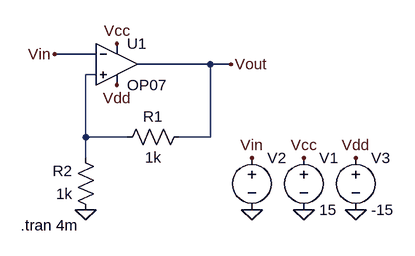
[diagram p0: schematic Trigger_2.asc]
Trigger_2.asc, the LTspice schematic file:
Version 4
SHEET 1 880 680
WIRE 80 64 16 64
WIRE 256 80 144 80
WIRE 288 80 256 80
WIRE 80 96 64 96
WIRE 64 192 64 96
WIRE 128 192 64 192
WIRE 256 192 256 80
WIRE 256 192 208 192
WIRE 64 224 64 192
FLAG 16 64 Vin
FLAG 320 224 Vin
FLAG 400 224 Vcc
FLAG 112 48 Vcc
FLAG 480 224 Vdd
FLAG 112 112 Vdd
FLAG 288 80 Vout
FLAG 64 304 0
FLAG 320 304 0
FLAG 400 304 0
FLAG 480 304 0
SYMBOL res 224 176 R90
WINDOW 0 0 56 VBottom 2
WINDOW 3 32 56 VTop 2
SYMATTR InstName R1
SYMATTR Value 1k
SYMBOL res 80 320 R180
WINDOW 0 36 76 Left 2
WINDOW 3 36 40 Left 2
SYMATTR InstName R2
SYMATTR Value 1k
SYMBOL voltage 400 208 R0
WINDOW 123 0 0 Left 0
WINDOW 39 0 0 Left 0
SYMATTR InstName V1
SYMATTR Value 15
SYMBOL voltage 320 208 R0
WINDOW 3 24 96 Invisible 2
WINDOW 123 0 0 Left 0
WINDOW 39 0 0 Left 0
SYMATTR InstName V2
SYMATTR Value PULSE(-15 15 0 1n 1n 0.5m 1m)
SYMBOL voltage 480 208 R0
WINDOW 123 0 0 Left 0
WINDOW 39 0 0 Left 0
SYMATTR InstName V3
SYMATTR Value -15
SYMBOL Opamps\\OP07 112 16 R0
SYMATTR InstName U1
TEXT -36 328 Left 2 !.tran 4m

The netlist it stands for:
* Trigger_2.asc
R1 Vout N001 1k
R2 0 N001 1k
V1 Vcc 0 15
V2 Vin 0 PULSE(-15 15 0 1n 1n 0.5m 1m)
V3 Vdd 0 -15
XU1 N001 Vin Vcc Vdd Vout LT1001  ; OP07, pins In+ In- V+ V- OUT
.tran 4m
.lib LTC.lib
.backanno
.end